# Altium schematic sheet XBR403-02.SchDoc
size A4
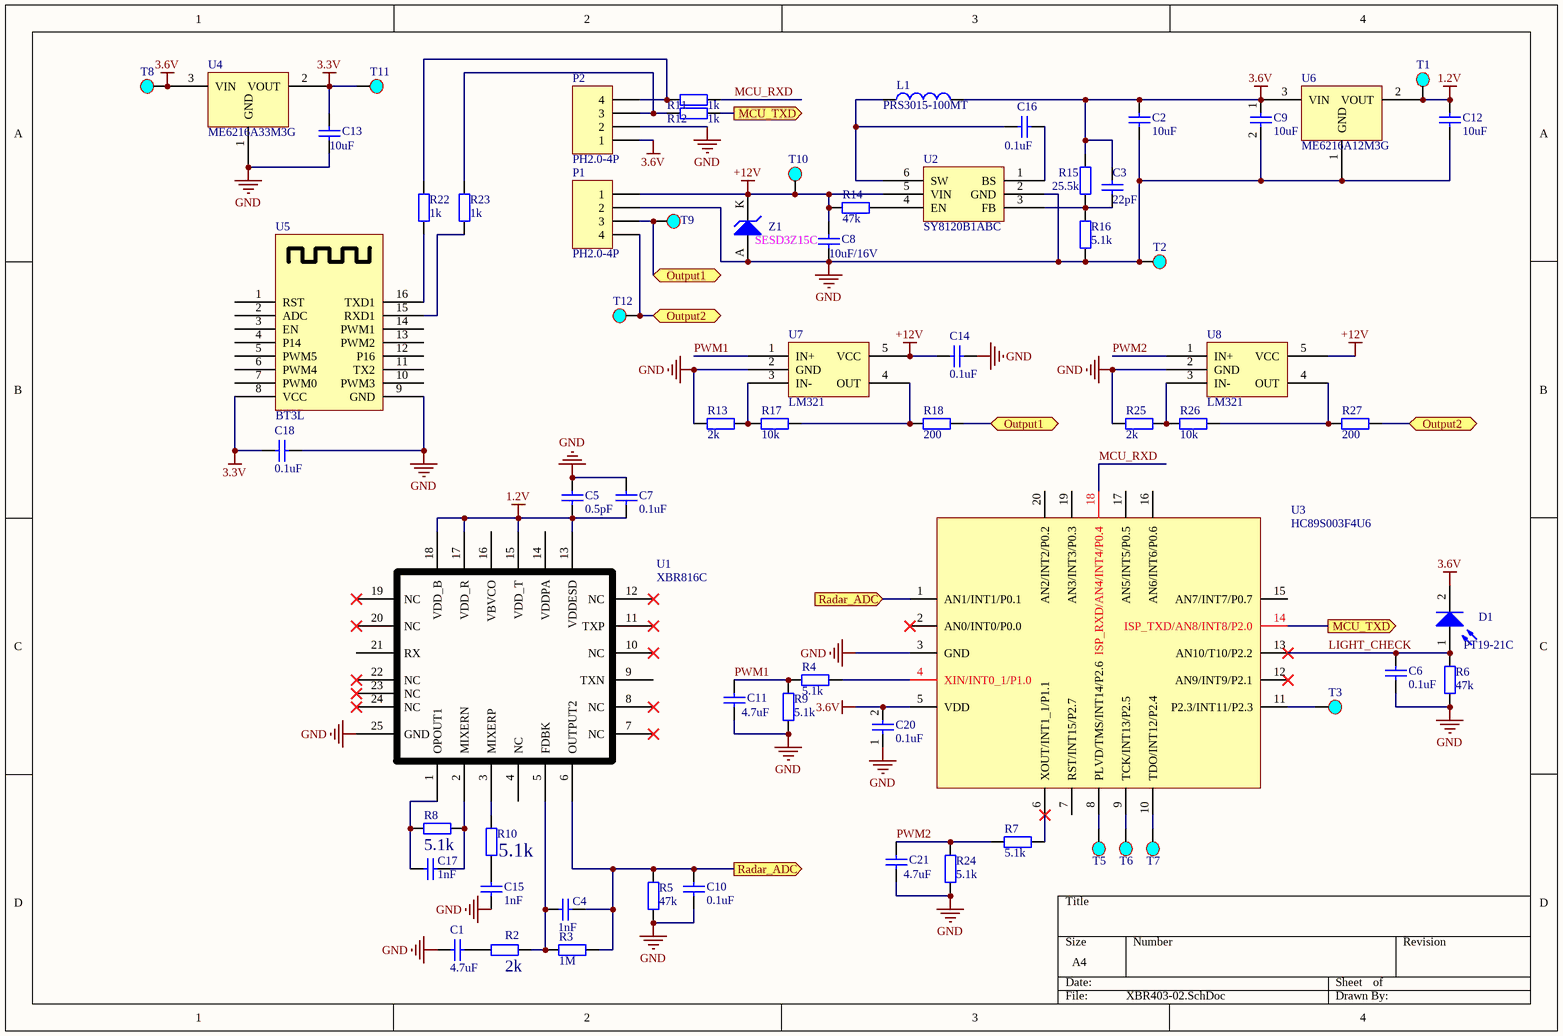
[diagram p0: XBR403-02.SchDoc]

## Parts
C1  4.7uF  [C0402]
C2  10uF  [C0402]
C3  22pF  [C0402]
C4  1nF  [C0402]
C5  0.5pF  [C0402]
C6  0.1uF  [C0402]
C7  0.1uF  [C0402]
C8  10uF/16V  [C0603]
C9  10uF  [C0402]
C10  0.1uF  [C0402]
C11  4.7uF  [C0402]
C12  10uF  [C0402]
C13  10uF  [C0402]
C14  0.1uF  [C0402]
C15  1nF  [C0402]
C16  0.1uF  [C0402]
C17  1nF  [C0402]
C18  0.1uF  [C0402]
C20  0.1uF  [C0402]
C21  4.7uF  [C0402]
D1  PT19-21C  [LED-0603]
L1  PRS3015-100MT  [PRS3015]
P1  PH2.0-4P  [PH2.0-4P]
P2  PH2.0-4P  [PH2.0-4P]
R2  2k  [R0402]
R3  1M  [R0402]
R4  5.1k  [R0402]
R5  47k  [R0402]
R6  47k  [R0402]
R7  5.1k  [R0402]
R8  5.1k  [R0402]
R9  5.1k  [R0402]
R10  5.1k  [R0402]
R11  1k  [R0402]
R12  1k  [R0402]
R13  2k  [R0402]
R14  47k  [R0402]
R15  25.5k  [R0402]
R16  5.1k  [R0402]
R17  10k  [R0402]
R18  200  [R0402]
R22  1k  [R0402]
R23  1k  [R0402]
R24  5.1k  [R0402]
R25  2k  [R0402]
R26  10k  [R0402]
R27  200  [R0402]
T1  (no value)  [TestPoints]
T2  (no value)  [TestPoints]
T3  (no value)  [TestPoints]
T5  (no value)  [TestPoints]
T6  (no value)  [TestPoints]
T7  (no value)  [TestPoints]
T8  (no value)  [TestPoints]
T9  (no value)  [TestPoints]
T10  (no value)  [TestPoints]
T11  (no value)  [TestPoints]
T12  (no value)  [TestPoints]
U1  XBR816C  [XBR816]
U2  SY8120B1ABC  [SOT-23-6]
U3  HC89S003F4U6  [QFN20(3*3)]
U4  ME6216A33M3G  [SOT-23-L]
U5  BT3L  [ZS3L]
U6  ME6216A12M3G  [SOT-23-L]
U7  LM321  [SOT23-5]
U8  LM321  [SOT23-5]
Z1  SESD3Z15C  [SOD323]

## Ports
MCU_TXD (out), Output1 (bidir), Output2 (bidir), Radar_ADC (in), Radar_ADC (out)

## Nets
1.2V: C5.1 C7.1 C12.1 T1.1 U1.13(VDDESD) U1.15(VDD_T) U1.17(VDD_R) U1.18(VDD_B) U6.2(VOUT)
3.3V: C13.1 C18.1 T11.1 U4.2(VOUT) U5.8(VCC)
3.6V: C2.1 C3.2 C9.1 C20.2 D1.2(K) L1.2 P2.1 R15.2 T8.1 U3.5(VDD) U4.3(VIN) U6.3(VIN)
+12V: C8.1 C14.1 P1.1 R14.2 T10.1 U2.5(VIN) U7.5(VCC) U8.5(VCC) Z1.K
GND: C1.2 C2.2 C5.2 C6.2 C7.2 C8.2 C9.2 C10.2 C11.2 C12.2 C13.2 C14.2 C15.1 C18.2 C20.1 C21.2 P1.2 P2.2 R5.2 R6.2 R9.2 R13.1 R16.1 R24.2 R25.1 T2.1 U1.25(GND) U2.2(GND) U3.3(GND) U4.1(GND) U5.9(GND) U6.1(GND) U7.2(GND) U8.2(GND) Z1.A
LIGHT_CHECK: C6.1 D1.1(A) R6.1 U3.13(AN10/T10/P2.2)
MCU_RXD: R11.1 U3.18(ISP_RXD/AN4/INT4/P0.4)
MCU_TXD: R12.1 U3.14(ISP_TXD/AN8/INT8/P2.0) ; port MCU_TXD
Output1: P1.3 R18.2 T9.1 ; port Output1
Output2: P1.4 R27.2 T12.1 ; port Output2
PWM1: C11.1 R4.2 R9.1 U7.1(IN+)
PWM2: C21.1 R7.2 R24.1 U8.1(IN+)
Radar_ADC: C4.1 C10.1 R3.1 R5.1 U1.6(OUTPUT2) U3.1(AN1/INT1/P0.1) ; port Radar_ADC
NetC1_1: C1.1 R2.1
NetC3_1: C3.1 R15.1 R16.2 U2.3(FB)
NetC4_2: C4.2 R2.2 R3.2 U1.5(FDBK)
NetC15_2: C15.2 R10.2
NetC16_1: C16.1 L1.1 U2.6(SW)
NetC16_2: C16.2 U2.1(BS)
NetC17_1: C17.1 R8.1 U1.2(MIXERN)
NetC17_2: C17.2 R8.2 U1.1(OPOUT1)
NetP2_3: P2.3 R12.2 R23.1
NetP2_4: P2.4 R11.2 R22.1
NetR4_1: R4.1 U3.4(XIN/INT0_1/P1.0)
NetR7_1: R7.1 U3.6(XOUT/INT1_1/P1.1)
NetR10_1: R10.1 U1.3(MIXERP)
NetR13_2: R13.2 R17.2 U7.3(IN-)
NetR14_1: R14.1 U2.4(EN)
NetR17_1: R17.1 R18.1 U7.4(OUT)
NetR22_2: R22.2 U5.16(TXD1)
NetR23_2: R23.2 U5.15(RXD1)
NetR25_2: R25.2 R26.2 U8.3(IN-)
NetR26_1: R26.1 R27.1 U8.4(OUT)
NetT3_1: T3.1 U3.11(P2.3/INT11/P2.3)
NetT5_1: T5.1 U3.8(PLVD/TMS/INT14/P2.6)
NetT6_1: T6.1 U3.9(TCK/INT13/P2.5)
NetT7_1: T7.1 U3.10(TDO/INT12/P2.4)

Not connected (* = marked no-connect by the designer): U1 4(NC) 7(NC)* 8(NC)* 9(TXN) 10(NC)* 11(TXP)* 12(NC)* 14(VDDPA) 16(VBVCO) 19(NC)* 20(NC)* 21(RX) 22(NC)* 23(NC)* 24(NC)*; U3 2(AN0/INT0/P0.0)* 7(RST/INT15/P2.7) 12(AN9/INT9/P2.1)* 15(AN7/INT7/P0.7) 16(AN6/INT6/P0.6) 17(AN5/INT5/P0.5) 19(AN3/INT3/P0.3) 20(AN2/INT2/P0.2); U5 1(RST) 2(ADC) 3(EN) 4(P14) 5(PWM5) 6(PWM4) 7(PWM0) 10(PWM3) 11(TX2) 12(P16) 13(PWM2) 14(PWM1)

## Library data of the parts
C1-C18 C20 C21 = Cap: Capacitor; Published: 8-Jun-2000; LatestRevisionDate: 17-Jul-2002; LatestRevisionNote: Re-released for DXP Platform.; PackageReference: RAD-0.3; Publisher: Altium Limited; PackageDescription: Radial Cap, Thru-Hole; 2 Leads; 0.3 in Pin Spacing
  C1 C11 C21: Value: 4.7uF
  C2 C9 C12 C13: Value: 10uF
  C3: Value: 22pF
  C4 C15 C17: Value: 1nF
  C5: Value: 0.5pF
  C6 C7 C10 C14 C16 C18 C20: Value: 0.1uF
  C8: Value: 10uF/16V
D1 = Photo Sen: Photosensitive Diode; Published: 24-Mar-1999; LatestRevisionDate: 17-Jul-2002; LatestRevisionNote: Re-released for DXP Platform.; PackageReference: PIN2; Publisher: Altium Limited; Value: PT19-21C
L1 = Inductor: Code_IEC: 1005; Published: 8-Jun-2000; LatestRevisionDate: 29-May-2009; LatestRevisionNote: IPC-7351 Footprint Added.; PackageReference: 0402-A; Publisher: Altium Limited; PackageDescription: Chip Inductor; Code_JEITA: 0402; Value: PRS3015-100MT
P1 P2 = Header 4: Header, 4-Pin; LatestRevisionDate: 17-Jul-2002; LatestRevisionNote: Re-released for DXP Platform.; Publisher: Altium Limited
R2-R18 R22-R27 = Res2: Resistor; Published: 8-Jun-2000; LatestRevisionDate: 17-Jul-2002; LatestRevisionNote: Re-released for DXP Platform.; PackageReference: AXIAL-0.4; Publisher: Altium Limited; PackageDescription: Axial Device, Thru-Hole; 2 Leads; 0.4 in Pin Spacing
  R2 R13 R25: Value: 2k
  R3: Value: 1M
  R4 R7-R10 R16 R24: Value: 5.1k
  R5 R6 R14: Value: 47k
  R11 R12 R22 R23: Value: 1k
  R15: Value: 25.5k
  R17 R26: Value: 10k
  R18 R27: Value: 200
T1-T3 T5-T12 = TestPoints
U1 = XBR1000_24_1
U2 = H9108
U3 = HC89S003F4: MCU
U4 U6 = SSP6206
U7 U8 = LMV321
Z1 = D Zener: Zener Diode; Published: 8-Jun-2000; LatestRevisionDate: 17-Jul-2002; LatestRevisionNote: Re-released for DXP Platform.; PackageReference: DIODE-0.7; Publisher: Altium Limited; PackageDescription: Diode, Thru-Hole; 2 Leads; 0.7 in Pin Spacing